# EasyEDA schematic Pi Zero Radio Alt Hat.json
TITLE: RFM95 Hat; REV: 1.0; Date: 2019-09-20; Sheet: 1/1; Drawn By: Vaughn Nugent; Company: GMU Satcom
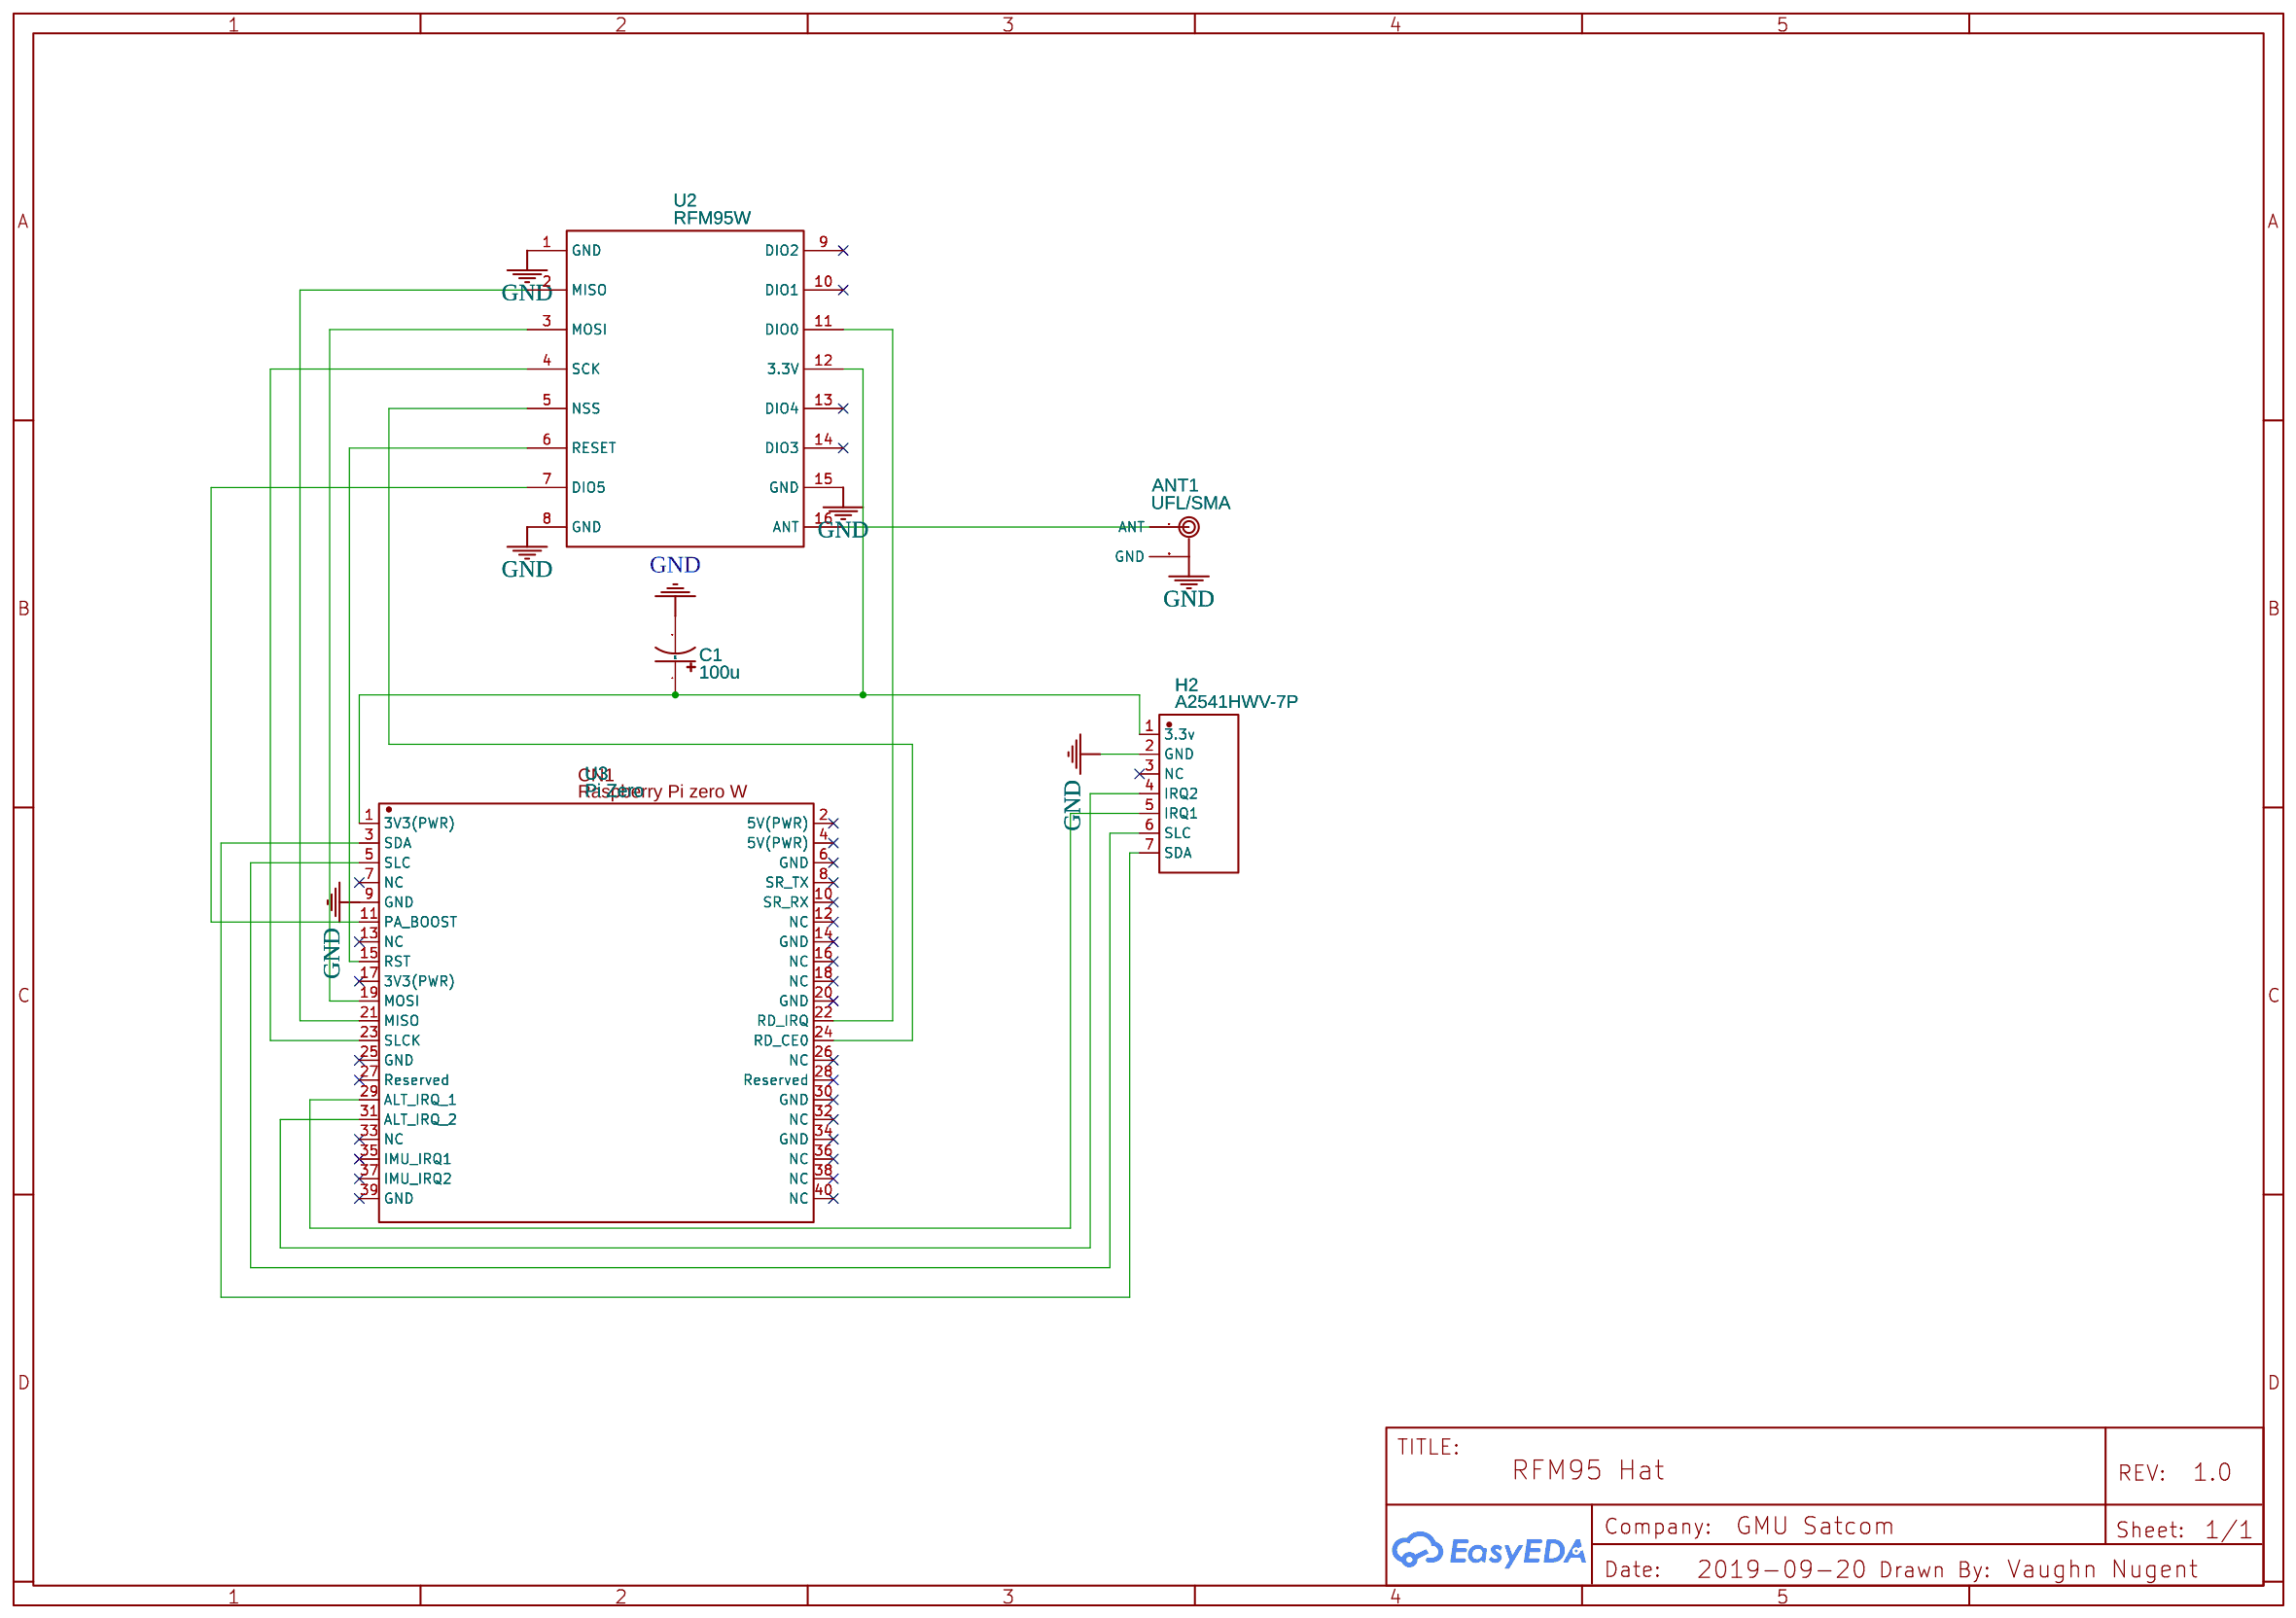
[diagram p0: schematic sheet]

## Parts
ANT1  UFL/SMA  [UFL/SMA]
C1  100u  [CAP-D3.0XF1.5]
H2  A2541HWV-7P  [HDR-TH_7P-P2.54-V_A2541HWV-7P]
U2  RFM95W  [RFM95W]
U3  Pi Zero  [PI ZERO WITH HOLES]

## Library data of the parts
ANT1 = -: Manufacturer Part: UFL/SMA anténa; Contributor: Joint1k
C1 = Cap_Electrolytic(TH)_D3.0XF1.5_US: Package Display: No
H2 = -: Supplier: LCSC; Supplier Part: C225504; Manufacturer: Changjiang Connectors; Contributor: LCSC
U2 = -: Contributor: Eliverto Moraes
U3 = -: Contributor: mayurharge

## Nets
GND: ANT1.GND C1.2(Neg) H2.2(GND) U2.1(GND) U2.8(GND) U2.15(GND) U3.9(GND)
Net-(ANT1-ANT): ANT1.ANT U2.16(ANT)
Net-(C1-1): C1.1(Pos) H2.1(3.3v) U2.12(3.3V) U3.1(3V3(PWR))
Net-(H2-4): H2.4(IRQ2) U3.31(ALT IRQ 2)
Net-(H2-5): H2.5(IRQ1) U3.29(ALT IRQ 1)
Net-(H2-6): H2.6(SLC) U3.5(SLC)
Net-(H2-7): H2.7(SDA) U3.3(SDA)
Net-(U2-2): U2.2(MISO) U3.21(MISO)
Net-(U2-3): U2.3(MOSI) U3.19(MOSI)
Net-(U2-4): U2.4(SCK) U3.23(SLCK)
Net-(U2-5): U2.5(NSS) U3.24(RD_CE0)
Net-(U2-6): U2.6(RESET) U3.15(RST)
Net-(U2-7): U2.7(DIO5) U3.11(PA_BOOST)
Net-(U2-11): U2.11(DIO0) U3.22(RD_IRQ)

Not connected (* = marked no-connect by the designer): H2 3(NC)*; U2 9(DIO2)* 10(DIO1)* 13(DIO4)* 14(DIO3)*; U3 2(5V(PWR))* 4(5V(PWR))* 6(GND)* 7(NC)* 8(SR_TX)* 10(SR_RX)* 12(NC)* 13(NC)* 14(GND)* 16(NC)* 17(3V3(PWR))* 18(NC)* 20(GND)* 25(GND)* 26(NC)* 27(Reserved)* 28(Reserved)* 30(GND)* 32(NC)* 33(NC)* 34(GND)* 35(IMU IRQ1)* 36(NC)* 37(IMU IRQ2)* 38(NC)* 39(GND)* 40(NC)*
